# EasyEDA Pro project ProPrj_智能视觉集成板-V1.1.epro, board PCB2
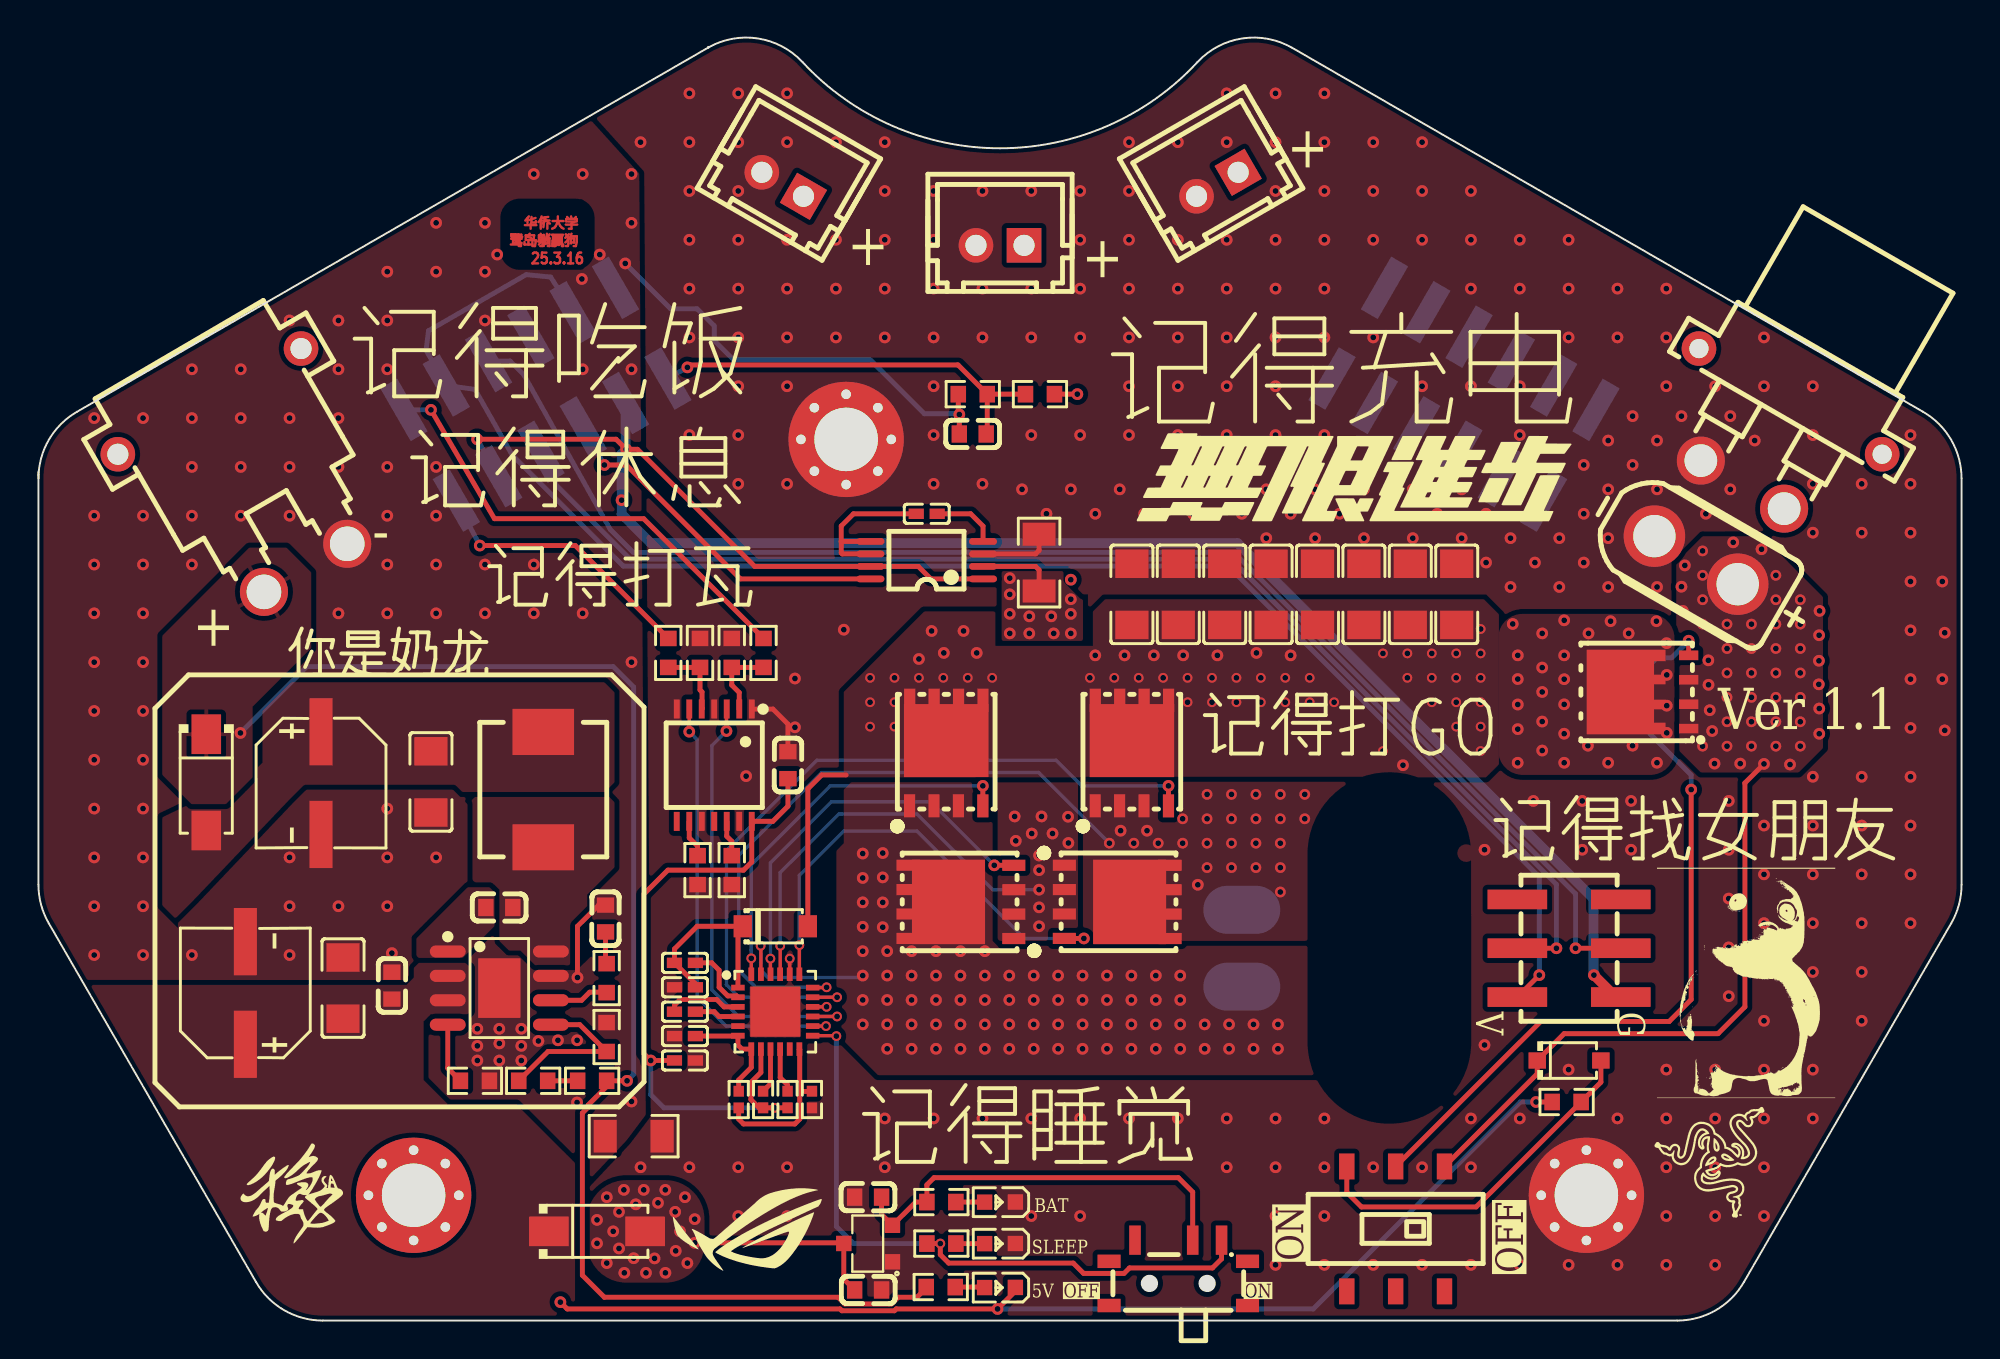
[diagram p13: board, top side]
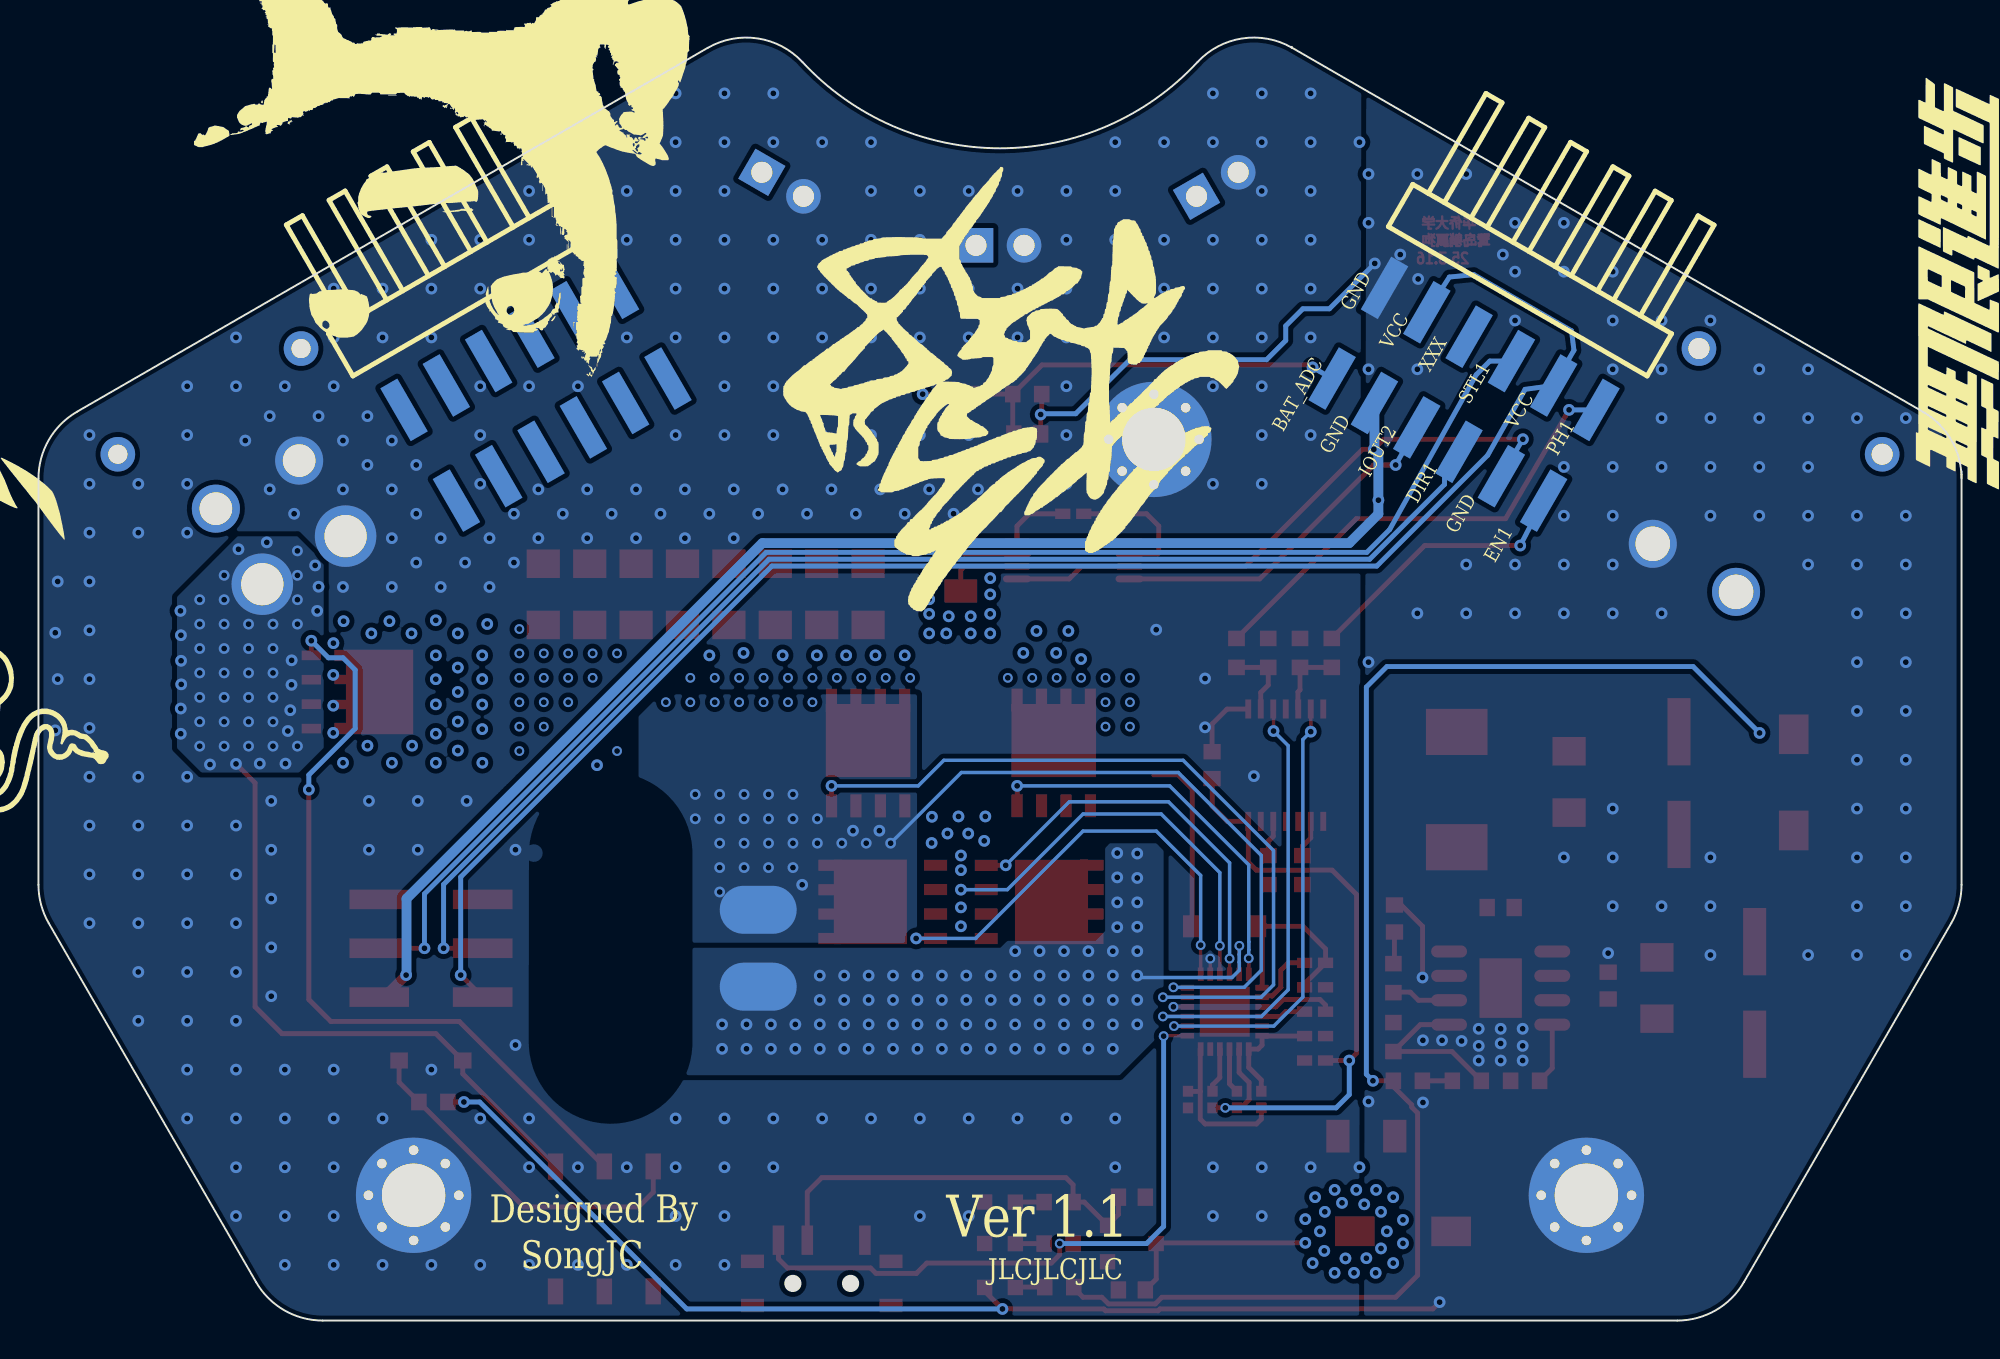
[diagram p14: board, bottom side, seen from below]

Outline 100 x 66.72 mm; copper layers: Top Layer, Inner1, Inner2, Bottom Layer. Coordinates in mm from the lower left corner of the outline.
Outline path: 0,44.19 0,22.67 arc(0.14,21.64) 0.54,20.67 11.32,2 arc(12.78,0.54) 14.78,0 85.22,0 arc(87.22,0.54) 88.68,2 99.46,20.67 arc(99.86,21.64) 100,22.67 100,43.82 arc(99.46,45.82) 98,47.29 65.2,66.22 arc(62.6,66.72) 60.27,65.48 arc(50,61) 39.73,65.48 arc(37.4,66.72) 34.82,66.24 arc(34.84,66.24) 34.84,66.25 2,47.29 arc(0.54,45.82) 0,43.82 ; 34.83,66.28 arc(34.83,66.28) 34.83,66.28
Stack: Top Layer 0.035mm 外层铜厚1oz / Dielectric1 0.2104mm 7628 RC49% 8.6mil / Inner1 0.0152mm 内层铜厚 / Dielectric2 1.065mm 1.1mm H/HOZ Copper / Inner2 0.0152mm 内层铜厚 / Dielectric3 0.2104mm 7628 RC49% 8.6mil / Bottom Layer 0.035mm 外层铜厚1oz

## Design rules (mm)
template: 自定义配置
spacing copperThickness1oz (default): track to track 0.102, other pairs 0.152 to 0.3
spacing copperThickness2oz: track to track 0.203, other pairs 0.152 to 0.3
track width copperThickness1oz (default): min 0.127, default 0.254, max 2.54
track width copperThickness2oz: min 0.203, default 0.254, max 2.54
differential pair differentialPair (default): width min 0.127, default 0.254, max 2.54; gap min 0.152, default 0.152
via viaSize (default): diameter min 0.5, default 0.61, max 10; hole min 0.3, default 0.305, max 6.3
net SH2_1 uses REALZHILIAN
net SH1_1 uses REALZHILIAN
net SP_1 uses REALZHILIAN
net GL1_1 uses REALZHILIAN
net VCC_BAT uses REALZHILIAN, innerPlane1
net GND_MOTO uses REALZHILIAN, innerPlane1
net $3N3808 uses REALZHILIAN
net GND_BAT uses REALZHILIAN, innerPlane1
net $3N3805 uses REALZHILIAN
net $3N3801 uses REALZHILIAN
net $3N3802 uses REALZHILIAN
net +12V_IN uses REALZHILIAN, innerPlane1

## Placement (name value [footprint] x y rotation side)
C12  100nF  [C0603]  48.58 46.13 0 top
C44  1nF  [C0603]  43.14 1.59 180 top
C45  1nF  [C0603]  43.14 6.42 0 top
C78  100uF  [CAP-SMD_BD6.3-L6.6-W6.6-LS7.4-FD]  10.76 17.05 90 top
C79  100nF  [C0603]  18.38 17.43 270 top
C80  4.7uF  [c1206]  15.84 17.3 270 top
C81  100nF  [C0603]  23.97 21.49 0 top
C82  47uF  [c1206]  20.41 28.03 90 top
C83  4.7nF  [C0603]  29.49 20.92 90 top
C84  100uF  [CAP-SMD_BD6.3-L6.6-W6.6-LS7.4-FD]  14.69 27.97 270 top
C94  22uF  [c1206]  61.68 37.79 270 top
C95  22uF  [c1206]  64.1 37.79 270 top
C96  22uF  [c1206]  66.51 37.79 270 top
C120  100nF  [C0402]  33.62 17.34 0 top
C121  100nF  [C0402]  33.62 18.61 0 top
C122  100nF  [C0402]  33.62 16.07 0 top
C126  1uF  [C0402]  33.62 14.8 0 top
C127  1uF  [C0402]  33.62 13.53 180 top
C130  100nF  [C0402]  46.19 41.98 0 top
C132  100nF  [C0603]  38.97 28.9 270 top
C133  22uF  [c1206]  56.86 37.79 270 top
C134  22uF  [c1206]  59.27 37.79 270 top
C135  22uF  [c1206]  68.92 37.79 270 top
C136  22uF  [c1206]  71.34 37.79 270 top
C142  22uF  [c1206]  73.75 37.79 270 top
CN6  XT30PW-M30.G.Y  [CONN-TH_XT30PW-M]  11.39 43.5 210 top
CN13  ZX-XH2.54-2PZZ  [CONN-TH_2P-P2.50_HX25003-2A]  38.7 59.12 150 top
CN14  ZX-XH2.54-2PZZ  [CONN-TH_2P-P2.50_HX25003-2A]  50 55.95 180 top
CN15  XT30UPB-F30.G.Y  [CONN-TH_XT30UPB-F]  86.19 39.57 150 top
CN16  ZX-XH2.54-2PZZ  [CONN-TH_2P-P2.50_HX25003-2A]  61.3 59.12 210 top
D2  BZT52C16  [SOD-123_L2.7-W1.7-LS3.8-RD]  79.59 13.53 0 top
D24  SS54  [SMA_L4.4-W2.8-LS5.4-R-RD]  29.04 4.64 0 top
D25  SS54  [SMA_L4.4-W2.8-LS5.4-R-RD]  8.72 28.01 270 top
D28  B5819W  [SOD-123_L2.8-W1.8-LS3.7-RD]  38.32 20.52 0 top
J1  -  [M3螺帽]  19.51 6.52 0 top
J3  -  [M3螺帽]  42 45.85 0 top
J4  -  [M3螺帽]  80.49 6.52 0 top
L4  4.7uH  [IND-SMD_L7.0-W6.6]  26.25 27.63 90 top
LED4  NCD0603R1  [LED0603-RD_RED]  50 6.17 180 top
LED5  NCD0603R1  [LED0603-RD_RED]  50 4.01 180 top
LED6  NCD0603R1  [LED0603-RD_RED]  50 1.72 180 top
Q11  TPH1R403NL  [POWERVDFN-8_L6.2-W5.2-P1.27-LS6.0-BL]  84.04 32.71 90 top
Q21  IRFH7440TRPBF  [DFN-8_L5.8-W4.9-P1.27-LS6.0-BL-1]  47.21 29.53 0 top
Q22  IRFH7440TRPBF  [DFN-8_L5.8-W4.9-P1.27-LS6.0-BL-1]  47.97 21.79 90 top
Q23  IRFH7440TRPBF  [DFN-8_L5.8-W4.9-P1.27-LS6.0-BL-1]  56.86 29.53 0 top
Q24  IRFH7440TRPBF  [DFN-8_L5.8-W4.9-P1.27-LS6.0-BL-1]  56.1 21.79 270 top
R10  10K  [R0603]  79.46 11.37 0 top
R13  200kΩ  [R0603]  52.08 48.21 180 top
R14  20kΩ  [R0603]  48.58 48.21 180 top
R68  2.2K  [R0603]  46.95 6.17 180 top
R69  2.2K  [R0603]  46.95 4.01 180 top
R89  100R  [R0603]  37.7 34.74 90 top
R90  100R  [R0603]  32.75 34.74 90 top
R126  200K  [R0603]  22.69 12.48 180 top
R127  51K  [R0603]  28.79 12.48 0 top
R128  1.5K  [R0603]  25.73 12.48 0 top
R129  10K  [R0603]  29.54 14.75 270 top
R130  4.7K  [R0603]  46.92 1.74 180 top
R131  20K  [R0603]  29.54 17.82 90 top
R161  10kΩ  [R0402]  37.68 11.5 90 top
R162  10kΩ  [R0402]  38.95 11.5 90 top
R165  1kΩ  [R0402]  36.41 11.5 270 top
R168  33kΩ  [R0402]  40.22 11.5 90 top
R173  10kΩ  [R0603]  34.4 34.74 270 top
R174  10kΩ  [R0603]  36.05 34.74 270 top
R175  10kΩ  [R0603]  34.27 23.44 90 top
R176  10kΩ  [R0603]  36.05 23.44 90 top
R180  0Ω  [R1206]  30.95 9.59 0 top
SW1  SS-3235S-L3  [SW-SMD_SS-3235S-L3.00]  70.57 4.77 0 top
SW4  MSK12C02  [SW-TH_MSK12C02]  59.27 2.48 0 top
U10  LR8341A-T33  [SOT-23-3L_L2.9-W1.6-P1.90-LS2.8-BL]  43.14 4.01 90 top
U11  SN74HC125PWR  [TSSOP-14_L5.0-W4.4-P0.65-LS6.5-BL]  35.14 28.9 180 top
U27  SP1N28STER  [ESOP-8_L4.9-W3.9-P1.27-LS6.0-BL-EP3.1]  23.97 17.3 270 top
U37  100mΩ  [R1206]  52.03 39.44 90 top
U39  DRV8701ERGER  [VQFN-24_L4.0-W4.0-P0.50-BL-EP2.5]  38.32 16.07 270 top
U41  INA240A2PWR  [TSSOP-8_L4.4-W3.0-P0.65-LS6.4-BL]  46.19 39.57 90 top
U56  XT30PW-F20.G.Y  [CONN-TH_XT30PW-F-1]  89.86 45.66 150 top
U58  PZ254-2-06-WS  [HDR-SMD_12P-P2.54_HCTL_PZ254-2-06-WS]  74.13 48.2 330 bottom
U60  -  [2P焊接端子（大电流）]  62.57 19.37 0 bottom
母版连接  PZ254-2-06-WS  [HDR-SMD_12P-P2.54_HCTL_PZ254-2-06-WS]  25.87 48.2 30 bottom
编码器1  PZ254-2-03-S  [HDR-SMD_6P-P2.54-V-M-R2-C3-LS7.5-2]  79.59 19.37 90 top

## Footprints (pads in the part's own frame, mm; a bottom-side part is the same pattern mirrored in y, then rotated)
2P焊接端子（大电流）
  oval 4x2.5 smd: 1(0,2) 2(0,-2)
C0402
  rect 0.79x0.54 smd: 1(-0.545,0) 2(0.545,0)
C0603
  rect 0.8x0.9 smd: 1(-0.7,0) 2(0.7,0)
c1206
  rect 1.485x1.728 smd: 1(-1.593,0) 2(1.593,0)
CAP-SMD_BD6.3-L6.6-W6.6-LS7.4-FD
  rect 3.5x1.2 smd: 1(-2.67,0) 2(2.67,0)
CONN-TH_2P-P2.50_HX25003-2A
  rect 1.8x1.8 hole 1.1: 1(-1.25,0)
  round 1.8 hole 1.1: 2(1.25,0)
CONN-TH_XT30PW-F-1
  round 2.5 hole 1.7: 1(-2.5,2.5) 2(2.5,2.5)
  round 1.8 hole 1: 3(5.5,-2.5) 4(-5.5,-2.5)
CONN-TH_XT30PW-M
  round 2.5 hole 1.8: 1(-2.5,5) 2(2.5,5)
  round 1.8 hole 1.1: 3(5.5,-5) 4(-5.5,-5)
CONN-TH_XT30UPB-F
  round 3.2 hole 2.2: 1(-2.5,0) 2(2.5,0)
DFN-8_L5.8-W4.9-P1.27-LS6.0-BL-1
  rect 0.58x1.2 smd: 1(-1.907,-2.75) 2(-0.637,-2.75) 3(0.632,-2.75) 4(1.903,-2.75) 5(1.907,2.75) 6(0.637,2.75) 7(-0.632,2.75) 8(-1.903,2.75)
  rect 4.4x3.8 smd: 9(0,0.646)
ESOP-8_L4.9-W3.9-P1.27-LS6.0-BL-EP3.1
  oval 0.63x1.865 smd: 1(-1.905,-2.683) 2(-0.635,-2.683) 3(0.635,-2.683) 4(1.905,-2.683) 5(1.905,2.683) 6(0.635,2.683) 7(-0.635,2.683) 8(-1.905,2.683)
  rect 3.1x2.2 smd: 9(0,0)
HDR-SMD_6P-P2.54-V-M-R2-C3-LS7.5-2
  rect 1.02x3.1 smd: 1(-2.54,-2.69) 2(-2.54,2.69) 3(0,-2.69) 4(0,2.69) 5(2.54,-2.69) 6(2.54,2.69)
HDR-SMD_12P-P2.54_HCTL_PZ254-2-06-WS
  rect 1.02x3.17 smd: 1(-6.35,-2.725) 2(-6.35,2.725) 3(-3.81,-2.725) 4(-3.81,2.725) 5(-1.27,-2.725) 6(-1.27,2.725) 7(1.27,-2.725) 8(1.27,2.725) 9(3.81,-2.725) 10(3.81,2.725) 11(6.35,-2.725) 12(6.35,2.725)
IND-SMD_L7.0-W6.6
  rect 2.4x3.2 smd: 1(-3,0) 2(3,0)
LED0603-RD_RED
  rect 0.8x0.8 smd: 1(-0.799,-0.004) 2(0.799,0.004)
M3螺帽
  round 6 hole 3.302: 1(0,0)
  round 1 hole 0.5: 2(0,2.349) 3(0,-2.349) 4(2.349,0) 5(-2.349,0) 6(1.651,1.651) 7(-1.651,-1.651) 8(1.651,-1.651) 9(-1.651,1.651)
POWERVDFN-8_L6.2-W5.2-P1.27-LS6.0-BL
  rect 0.5x1 smd: 1(-1.905,-1.775) 2(-0.635,-1.775) 3(0.635,-1.775) 4(1.905,-1.775)
  custom 4.4x4.1 smd: 5(0,1.775)
R0402
  rect 0.566x0.54 smd: 1(-0.433,0) 2(0.433,0)
R0603
  rect 0.806x0.864 smd: 1(-0.753,0) 2(0.753,0)
R1206
  rect 1.208x1.701 smd: 1(-1.479,0) 2(1.479,0)
SMA_L4.4-W2.8-LS5.4-R-RD
  rect 2.062x1.539 smd: 1(2.503,0) 2(-2.503,0)
SOD-123_L2.7-W1.7-LS3.8-RD
  rect 0.91x0.84 smd: 1(-1.655,0) 2(1.655,0)
SOD-123_L2.8-W1.8-LS3.7-RD
  rect 0.95x1.15 smd: 1(-1.692,0) 2(1.692,0)
SOT-23-3L_L2.9-W1.6-P1.90-LS2.8-BL
  rect 0.8x0.8 smd: 1(-0.95,-1.265) 2(0.95,-1.265) 3(0.005,1.265)
SW-SMD_SS-3235S-L3.00
  rect 0.8x1.35 smd: 1(-2.54,3.25) 2(0,3.25) 3(2.54,3.25) 4(-2.54,-3.25) 5(0,-3.25) 6(2.54,-3.25)
SW-TH_MSK12C02
  rect 0.6x1.524 smd: 1(-2.25,1.7) 2(0.75,1.7) 3(2.25,1.7)
  rect 1.2x0.7 smd: 4(-3.6,0.6) 4(-3.6,-1.7) 4(3.6,0.6) 4(3.6,-1.7)
TSSOP-8_L4.4-W3.0-P0.65-LS6.4-BL
  oval 0.353x1.454 smd: 1(-0.975,-2.927) 2(-0.325,-2.927) 3(0.325,-2.927) 4(0.975,-2.927) 5(0.975,2.927) 6(0.325,2.927) 7(-0.325,2.927) 8(-0.975,2.927)
TSSOP-14_L5.0-W4.4-P0.65-LS6.5-BL
  rect 0.305x0.991 smd: 1(-1.95,-2.925) 2(-1.3,-2.925) 3(-0.65,-2.925) 4(0,-2.925) 5(0.65,-2.925) 6(1.3,-2.925) 7(1.95,-2.925) 8(1.95,2.925) 9(1.3,2.925) 10(0.65,2.925) 11(0,2.925) 12(-0.65,2.925) 13(-1.3,2.925) 14(-1.95,2.925)
VQFN-24_L4.0-W4.0-P0.50-BL-EP2.5
  rect 0.3x0.7 smd: 1(-1.25,-1.942) 2(-0.75,-1.942) 3(-0.25,-1.942) 4(0.25,-1.942) 5(0.75,-1.942) 6(1.25,-1.942) 13(1.25,1.942) 14(0.75,1.942) 15(0.25,1.942) 16(-0.25,1.942) 17(-0.75,1.942) 18(-1.25,1.942)
  rect 0.7x0.3 smd: 7(1.948,-1.25) 8(1.948,-0.75) 9(1.948,-0.25) 10(1.948,0.25) 11(1.948,0.75) 12(1.948,1.25) 19(-1.948,1.25) 20(-1.948,0.75) 21(-1.948,0.25) 22(-1.948,-0.25) 23(-1.948,-0.75) 24(-1.948,-1.25)
  rect 2.6x2.6 smd: 25(0.001,-0.001)

## Nets
As in the schematic, except:
GND_BAT: C12.1 C78.2 C79.1 C80.1 C82.1 C83.2 C84.2 CN6.1 J1.1 J1.2 J1.3 J1.4 J1.5 J1.6 J1.7 J1.8 J1.9 LED6.1 R10.1 R14.2 R126.1 R129.1 R180.1 U27.7 U27.9 母版连接.11
GND_MOTO: C44.1 C45.1 C94.1 C95.1 C96.1 C120.1 C126.1 C127.1 C132.1 C133.1 C134.1 C135.1 C136.1 C142.1 CN13.2 CN14.2 CN15.2 CN16.2 J3.1 J3.2 J3.3 J3.4 J3.5 J3.6 J3.7 J3.8 J3.9 J4.1 J4.2 J4.3 J4.4 J4.5 J4.6 J4.7 J4.8 J4.9 LED4.1 LED5.1 R168.1 R173.1 R174.1 R175.1 R176.1 R180.2 U10.1 U11.1 U11.4 U11.7 U11.10 U11.13 U37.2 U39.5 U39.16 U39.20 U39.25 U41.3 U56.2

Pads without a net: CN6 3 4; SW1 4 5 6; SW4 1 4; U11 8 11; U39 11; U56 3 4; U58 1 2 3 4 5 6 7 8 9 10 11 12; 母版连接 7; 编码器1 5 6

## Via types
v1: diameter 0.508, hole 0.305, Top Layer to Bottom Layer, 58 vias
v2: diameter 0.61, hole 0.305, Top Layer to Bottom Layer, 586 vias
v3: diameter 0.559, hole 0.305, Top Layer to Bottom Layer, 56 vias

## Routing (per net, layer and track width the routed paths; a pad name or vN(x,y) marks a point on that pad's centre or on a via; arc(x,y) is an arc through that point)
+3V3: length 21.7
  Top Layer w0.254: C45.2 43.84,5.52 44.41,4.96 45.62,6.17 R68.2 46.2,7.06 46.57,7.44 59.27,7.44 60.02,6.69 SW4.2
+12V_IN: length 32.5
  Top Layer w0.254: v2(89.73,28.97) 88.74,27.97 88.74,16.33 87.34,14.93 79.33,14.93 D2.1 77.94,12.84 SW1.3
  vias: v2(85.44,38.19) v2(85.51,36.93) v2(85.61,39.3) v2(86.83,34.36) v2(86.84,33.08) v2(86.91,31.76) v2(87.03,30.68) v2(87.16,28.98) v2(88.13,40.49) v2(88.49,28.98) v2(89.6,40.14) v2(91.08,28.93) v2(92.62,36.93) v2(92.59,35.66) v2(92.59,34.33) v2(92.58,33.11) v2(92.6,31.85) v2(92.6,30.53) v3(86.53,40.05) v3(86.53,38.78) v3(86.53,37.51) v3(86.53,36.24) v3(86.53,29.89) v3(87.81,36.24) v3(87.81,34.97) v3(87.81,33.7) v3(87.81,32.43) v3(87.81,31.16) v3(87.81,29.89) v3(89.07,36.24) v3(89.07,34.97) v3(89.07,33.7) v3(89.07,32.43) v3(89.07,31.16) v3(89.07,29.89) v3(90.34,38.78) v3(90.34,37.51) v3(90.34,36.24) v3(90.34,34.97) v3(90.34,33.7) v3(90.34,32.43) v3(90.34,31.16) v3(90.34,29.89) v3(91.62,37.51) v3(91.62,36.24) v3(91.62,34.97) v3(91.62,33.7) v3(91.62,32.43) v3(91.62,31.16) v3(91.62,29.89)
AVDD_1: length 6
  Top Layer w0.254: C126.2 36.35,14.8 U39.6 36.37,14.33 36.58,14.13 U39.7 37.07,13.17 36.41,12.52 R165.1
DVDD_1: length 35.5
  Top Layer w0.254: 33.07,13.53 v2(31.84,13.53) 31.46,13.91 31.46,22.17 32.73,23.44 36.66,23.44 37.09,23.86 37.09,25.97 37.09,25.98 38.19,25.98 38.97,26.76 C132.2 ; R162.1 v1(38.28,11.07) R161.1 37.48,11.07 37.05,11.5 37.05,12.39 37.57,12.91 U39.8
  Bottom Layer w0.254: v1(38.28,11.07) 32.52,11.07 31.84,11.75 v2(31.84,13.53)
GND_BAT: length 85.5
  Top Layer w0.254: C83.2 29.13,21.62 28.03,20.52 v2(28.03,17.85) ; LED6.1 50.8,1.53 v2(49.87,0.6) 44.6,0.6 44.5,0.51 41.78,0.51 41.68,0.6 27.49,0.6 v2(27.14,0.96) ; R14.2 47.83,47.2 v2(47.88,47.15) C12.1 ; R10.1 v2(77.88,11.37)
  Bottom Layer w0.254: v2(47.88,47.15) 47.85,47.19 46.06,47.19 43.25,50 36.14,50 35.14,51 35.14,51.76 34.25,52.65 32.87,52.65 v2(30.51,55.01) ; v2(77.88,11.37) 77.06,11.37 66.29,0.6 v2(49.87,0.6)
  vias: v2(2.9,46.96) v2(2.9,41.88) v2(2.9,39.34) v2(2.9,36.8) v2(2.9,34.26) v2(2.9,31.72) v2(2.9,29.18) v2(2.9,26.64) v2(2.9,24.1) v2(2.9,21.56) v2(2.9,19.02) v2(5.44,46.96) v2(5.44,41.88) v2(5.44,39.34) v2(5.44,36.8) v2(5.44,34.26) v2(5.44,31.72) v2(5.44,29.18) v2(5.44,26.64) v2(5.44,24.1) v2(5.44,21.56) v2(5.44,19.02) v2(7.98,49.5) v2(7.98,46.96) v2(7.98,44.42) v2(7.98,41.88) v2(7.98,39.34) v2(7.98,19.02) v2(10.52,49.5) v2(10.52,46.96) v2(10.52,44.42) v2(10.52,41.88) v2(13.06,52.04) v2(13.06,46.96) v2(13.06,44.42) v2(13.06,41.88) v2(13.06,24.1) v2(13.06,21.56) v2(13.06,19.02) v2(15.6,52.04) v2(15.6,49.5) v2(15.6,46.96) v2(15.6,44.42) v2(15.6,36.8) v2(15.6,21.56) v2(18.14,54.58) v2(18.14,52.04) v2(18.14,49.5) v2(18.14,44.42) v2(18.14,41.88) v2(18.14,39.34) v2(18.14,36.8) v2(18.14,26.64) v2(18.14,24.1) v2(18.14,21.56) v2(18.38,19.12) v2(20.68,57.12) v2(20.68,54.58) v2(20.68,44.42) v2(20.68,41.88) v2(20.68,39.34) v2(20.68,36.8) v2(20.68,24.1) v2(22.82,15.18) v2(22.82,14.29) v2(22.82,13.53) v2(23.22,57.12) v2(23.22,54.58) v2(23.22,52.04) v2(23.22,39.34) v2(23.22,36.8) v2(23.85,55.47) v2(23.97,15.18) v2(23.97,14.42) v2(23.97,13.53) v2(25.11,15.18) v2(25.11,14.29) v2(25.11,13.53) v2(25.76,59.66) v2(25.76,39.34) v2(25.76,36.8) v2(26,14.55) v2(27.01,14.58) v2(28.01,14.58) v2(28.01,11.35) v2(28.3,59.66) v2(28.26,54.2) v2(28.3,49.5) v2(28.3,36.8) v2(29.19,55.47) v2(30.84,59.66) v2(30.84,57.12) v2(30.84,49.5) v2(30.84,34.26) v2(30.84,11.4)
GND_MOTO: length 9
  Top Layer w0.178: U39.16 40.98,16.32 v1(40.98,16.33) ; v1(39.07,18.84) U39.20
  Top Layer w0.254: C132.1 38.97,31.04 38.19,31.82 37.09,31.82 37.09,31.82 ; U37.2 52.03,40.08 51.85,39.89 U41.3
  vias: v2(31.31,61.32) v2(31.31,7.98) v2(33.85,63.86) v2(33.85,61.32) v2(33.85,58.78) v2(33.85,56.24) v2(33.85,53.7) v2(33.85,51.16) v2(33.85,46.08) v2(33.85,7.98) v2(36.39,63.86) v2(36.39,61.32) v2(36.39,58.78) v2(36.39,56.24) v2(36.39,53.7) v2(36.39,51.16) v2(36.39,48.62) v2(36.39,46.08) v2(36.39,43.54) v2(36.39,7.98) v2(36.39,5.44) v2(36.8,28.33) v2(38.93,63.86) v2(38.93,61.32) v2(38.93,56.24) v2(38.93,53.7) v2(38.93,51.16) v2(38.93,48.62) v2(38.93,43.54) v2(38.93,7.98) v2(38.93,5.44) v2(39.34,33.41) v2(39.34,30.87) v2(41.47,61.32) v2(41.47,56.24) v2(41.47,53.7) v2(41.47,51.16) v2(41.88,35.95) v2(44.01,61.32) v2(44.01,58.78) v2(44.01,56.24) v2(44.01,53.7) v2(44.01,51.16) v2(44.01,10.52) v2(44.01,7.98) v2(46.55,58.78) v2(46.55,56.24) v2(46.55,53.7) v2(46.55,51.16) v2(46.55,48.62) v2(46.55,46.08) v2(46.55,43.54) v2(46.55,10.52) v2(49.09,58.78) v2(49.09,53.7) v2(49.09,51.16) v2(49.09,43.54) v2(49.09,10.52) v2(51.15,43.25) v2(51.63,58.78) v2(51.63,53.7) v2(51.63,51.16) v2(51.63,46.08) v2(51.63,10.52) v2(51.63,5.44) v2(52.42,41.98) v2(53.69,43.25) v2(54.17,58.78) v2(54.17,56.24) v2(54.17,53.7) v2(54.17,51.16) v2(54.17,46.08) v2(54.17,10.52) v2(54.17,5.44) v2(54.96,41.98) v2(56.23,43.25) v2(56.71,61.32) v2(56.71,58.78) v2(56.71,56.24) v2(56.71,53.7) v2(56.71,51.16) v2(56.71,48.62) v2(56.71,46.08) v2(56.71,10.52) v2(57.5,41.98) v2(58.77,43.25) v2(59.25,61.32) v2(59.25,56.24) v2(59.25,53.7) v2(59.25,51.16) v2(59.25,48.62) v2(59.25,46.08) v2(59.25,10.52) v2(60.04,41.98) v2(61.31,43.25) v2(61.79,63.86) v2(61.79,61.32) v2(61.79,56.24) v2(61.79,53.7) v2(61.79,51.16) v2(61.79,48.62) v2(61.79,46.08) v2(61.79,10.52) v2(61.79,7.98) v2(62.58,41.98) v2(63.85,43.25) v2(63.85,40.71) v2(64.33,63.86) v2(64.33,61.32) v2(64.33,58.78) v2(64.33,56.24) v2(64.33,53.7) v2(64.33,51.16) v2(64.33,48.62) v2(64.33,46.08) v2(64.33,10.52) v2(64.33,7.98) v2(64.33,5.44) v2(64.33,2.9) v2(65.12,41.98) v2(66.39,43.25) v2(66.39,40.71) v2(66.87,63.86) v2(66.87,61.32) v2(66.87,58.78) v2(66.87,56.24) v2(66.87,53.7) v2(66.87,51.16) v2(66.87,46.08) v2(66.87,10.52) v2(66.87,7.98) v2(66.87,5.44) v2(66.87,2.9) v2(67.66,41.98) v2(68.93,43.25) v2(68.93,40.71) v2(69.41,61.32) v2(69.41,58.78) v2(69.41,56.24) v2(69.41,51.16) v2(69.41,7.98) v2(69.41,2.9) v2(70.2,41.98) v2(71.47,43.25) v2(71.47,40.71) v2(71.95,61.32) v2(71.95,58.78) v2(71.95,56.24) v2(71.95,48.62) v2(71.95,7.98) v2(71.95,2.9) v2(72.74,41.98) v2(74.01,43.25) v2(74.01,40.71) v2(74.49,58.78) v2(74.49,56.24) v2(74.49,53.7) v2(74.49,48.62) v2(74.49,10.52) v2(74.49,7.98) v2(74.49,2.9) v2(75.2,24.5) v2(75.2,14.34) v2(75.28,41.98) v2(75.28,39.44) v2(76.55,40.71) v2(76.55,38.17) v2(77.03,56.24) v2(77.03,53.7) v2(77.03,48.62) v2(77.03,46.08) v2(77.03,43.54) v2(77.03,10.52) v2(77.03,2.9) v2(77.74,27.04) v2(77.82,39.44) v2(79.09,40.71) v2(79.09,38.17) v2(79.57,56.24) v2(79.57,53.7) v2(79.57,51.16) v2(79.57,13.06) v2(79.57,2.9) v2(80.28,27.04) v2(80.28,24.5) v2(80.36,44.52) v2(80.36,41.98) v2(80.36,39.44) v2(81.63,45.79) v2(81.63,43.25) v2(81.63,40.71) v2(81.63,38.17) v2(82.11,53.7) v2(82.11,51.16) v2(82.11,10.52) v2(82.11,2.9) v2(82.82,27.04) v2(82.82,24.5) v2(82.9,47.06) v2(82.9,44.52) v2(84.17,45.79) v2(84.17,43.25) v2(84.17,38.17) v2(84.65,53.7) v2(84.65,51.16) v2(84.65,48.62) v2(84.65,13.06) v2(84.65,10.52) v2(84.65,7.98) v2(84.65,5.44) v2(84.65,2.9) v2(85.44,47.06) v2(86.71,41.98) v2(87.19,48.62) v2(87.19,13.06) v2(87.19,10.52) v2(87.19,7.98) v2(87.19,5.44) v2(87.19,2.9) v2(87.9,27.04) v2(87.9,24.5) v2(87.9,21.96) v2(87.9,19.42) v2(87.9,16.88) v2(87.98,47.06) v2(87.98,43.25) v2(89.25,45.79) v2(89.73,51.16) v2(89.73,48.62) v2(89.73,25.76) v2(89.73,23.22) v2(89.73,20.68) v2(89.73,18.14) v2(89.73,15.6) v2(89.73,13.06) v2(89.73,10.52) v2(89.73,7.98) v2(89.73,5.44) v2(92.27,48.62) v2(92.27,46.08) v2(92.27,43.54) v2(92.27,41) v2(92.27,28.3) v2(92.27,25.76) v2(92.27,23.22) v2(92.27,20.68) v2(92.27,18.14) v2(92.27,15.6) v2(92.27,13.06) v2(92.27,10.52) v2(94.81,43.54) v2(94.81,41) v2(94.81,28.3) v2(94.81,25.76) v2(94.81,23.22) v2(94.81,20.68) v2(94.81,18.14) v2(94.81,15.6) v2(97.35,46.08) v2(97.35,43.54) v2(97.35,41) v2(97.35,38.46) v2(97.35,35.92) v2(97.35,33.38) v2(97.35,30.84) v2(97.35,28.3) v2(97.35,25.76) v2(97.35,23.22) v2(97.35,20.68) v2(99,38.46) v2(99,33.38) v2(99.13,35.79) v2(99.13,30.71)
GND_PRO: length 102.1
  Top Layer w0.254: U41.1 46.4,38.59 45.75,39.24 U41.7 37.24,39.24 31.15,45.34 v2(30.56,45.34) 30.03,45.86 v2(22.81,45.86)
  Top Layer w0.508: v2(80.88,17.98) 82.03,16.83 编码器1.1
  Bottom Layer w0.254: v2(22.81,45.86) 母版连接.4
  Bottom Layer w0.508: 母版连接.10 30.53,45.37 v2(30.56,45.34) 30.32,45.1 v2(30.32,42.69) 30.32,41.97 31.84,40.46 62.36,40.46 80.86,21.95 80.86,18 v2(80.88,17.98)
VCC_3V3: length 87.1
  Top Layer w0.254: v2(78.04,17.98) 编码器1.2
  Bottom Layer w0.254: v2(78.04,17.98) 78.04,23.08 61.86,39.26 30.41,39.26 24.64,45.03 22.69,48.46 母版连接.3 20.16,50.49 20.28,51.5 25.36,54.43 26.63,54.3 母版连接.9
VCC_+5V: length 73.7
  Top Layer w0.254: 29.84,12.48 R127.2 ; 29.84,12.48 v2(30.61,12.48) ; 29.84,12.48 28.59,11.22 28.59,11.11 28.28,10.8 28.28,2.36 29.43,1.21 41.58,1.21 41.93,0.87 44.36,0.87 44.71,1.21 45.68,1.21 46.17,1.7 R130.2
  Bottom Layer w0.254: v2(30.61,12.48) 30.95,12.82 30.95,32.96 29.88,34.03 13.96,34.03 v2(10.5,30.58)
VCC_BAT: length 21.1
  Top Layer w0.254: C44.2 41.88,2.16 U10.3 41.84,4.05 v2(34.12,4.05) ; D28.2 40.01,27.67 40.73,28.39 42,28.39 ; R13.1 v2(54.02,48.21)
  vias: v1(43.24,33.45) v1(43.24,32.18) v1(43.24,30.91) v1(44.51,33.45) v1(44.51,32.18) v1(44.51,30.91) v1(45.78,33.45) v1(47.05,33.45) v1(48.32,33.45) v1(49.59,33.45) v1(54.67,33.45) v1(55.94,33.45) v1(57.21,33.45) v1(58.48,33.45) v1(59.75,33.45) v1(59.75,32.18) v1(61.02,33.45) v1(61.02,32.18) v1(62.29,33.45) v1(62.29,32.18) v1(63.56,33.45) v1(63.56,32.18) v1(64.83,33.45) v1(64.83,32.18) v1(66.1,33.45) v1(66.1,32.18) v1(67.37,32.18) v1(69.91,34.72) v1(69.91,29.64) v1(71.18,34.72) v1(71.18,33.45) v1(72.45,34.72) v1(72.45,33.45) v1(72.45,32.18) v1(73.72,34.72) v1(73.72,33.45) v1(73.72,32.18) v1(73.72,30.91) v1(74.99,35.99) v1(74.99,34.72) v1(74.99,33.45) v1(74.99,32.18) v1(74.99,30.91) v1(74.99,29.64) v2(29.04,5.24) v2(29.04,4.02) v2(29.55,6.42) v2(29.55,2.99) v2(29.89,4.64) v2(30.19,5.66) v2(30.19,3.75) v2(30.44,6.8) v2(30.47,2.48) v2(30.95,3.25) v2(31.06,6.05) v2(31.47,6.8) v2(31.59,2.48) v2(32.04,3.24) v2(32.22,6.12) v2(32.6,6.8) v2(32.6,2.48) v2(33.11,5.66) v2(33.14,3.63) v2(33.36,4.64) v2(33.62,6.42) v2(33.74,2.99) v2(34.12,5.28) v2(45.78,34.43) v2(46.44,35.88) v2(47.08,34.74) v2(48.1,35.88) v2(48.79,34.74) v2(54.95,34.61) v2(56.48,34.61) v2(58,34.61) v2(59.53,34.61) v2(61.3,34.61) v2(63.34,34.74) v2(65.11,34.61) v2(70.96,28.9) v2(76.66,36.25) v2(76.92,34.61) v2(76.92,33.38) v2(76.92,32.06) v2(76.92,30.78) v2(76.92,29.03) v2(78.19,35.76) v2(78.19,33.98) v2(78.19,32.71) v2(78.19,31.17) v2(78.19,29.66) v2(79.34,36.44) v2(79.34,34.61) v2(79.34,33.37) v2(79.34,32.06) v2(79.34,30.54) v2(79.34,29.03) v2(80.6,35.76) v2(80.57,29.92) v2(81.62,29.03) v2(81.75,36.39) v2(82.69,35.76) v2(82.89,29.92) v2(84.13,36.39) v2(84.16,29.03) v2(84.66,35.25) v2(84.67,33.6) v2(84.67,32) v2(84.67,30.58)
BAT_ADC: length 21.5
  Top Layer w0.254: R14.1 47.82,49.73 33.87,49.73 v2(33.74,49.6) ; R14.1 R13.2 ; R14.1 49.34,46.19 C12.2
  Bottom Layer w0.254: v2(33.74,49.6) 母版连接.12
EN-IN_1: length 3.9
  Top Layer w0.254: U11.5 34.51,31.84 34.51,32.71 34.4,32.81 R173.2 R90.1
EN_1: length 23.2
  Top Layer w0.178: v2(33.84,30.64) U11.6 ; v1(40.95,15.32) U39.14
  Bottom Layer w0.178: v2(33.84,30.64) 34.25,30.23 34.25,16.83 35.76,15.32 v1(40.95,15.32)
ENCODER_DIR_1: length 68
  Top Layer w0.254: v2(78.93,19.37) 编码器1.4
  Bottom Layer w0.254: v2(78.93,19.37) 78.93,22.69 62.01,39.62 30.78,39.62 26.89,43.51 26.89,44.45 母版连接.6
ENCODER_STL_1: length 74.6
  Top Layer w0.254: v2(79.93,19.37) 编码器1.3
  Bottom Layer w0.254: 23.41,49.93 24.53,49.93 25.23,49.22 29.74,41.16 30.93,39.97 62.16,39.97 79.93,22.2 v2(79.93,19.37)
ENIN_1: length 14.4
  Top Layer w0.254: v2(22.95,40.33) 27.91,40.33 R90.2
  Bottom Layer w0.254: v2(22.95,40.33) 21.73,42.67
GH1_1: length 40.8
  Top Layer w0.178: v1(41.53,16.82) U39.17
  Top Layer w0.254: v2(58.76,27.82) Q23.4
  Bottom Layer w0.178: v1(41.53,16.82) 36.42,16.82 35.78,17.47 35.78,24.45 40.47,29.15 52.92,29.15 54.25,27.82 v2(58.76,27.82)
GH2_1: length 20.5
  Top Layer w0.178: v1(37.07,18.85) U39.24
  Top Layer w0.254: v2(49.11,27.82) Q21.4
  Bottom Layer w0.178: v1(37.07,18.85) 37.07,19.29 37.06,19.3 37.06,19.71 37.07,19.71 37.07,23.71 41.18,27.82 v2(49.11,27.82)
GL1_1: length 24.2
  Top Layer w0.178: v1(39.57,19.54) U39.19
  Top Layer w0.254: v2(54.36,19.88) Q24.4
  Bottom Layer w0.178: v2(54.36,19.88) 51.27,19.88 45.68,25.47 41.87,25.47 39.57,23.16 v1(39.57,19.54)
GL2_1: length 21.1
  Top Layer w0.178: U39.22 38.06,18.03 v1(38.06,18.84)
  Top Layer w0.254: v2(49.7,23.69) Q22.4
  Bottom Layer w0.178: v1(38.06,18.84) 38.06,23.82 41.24,26.99 46.4,26.99 v2(49.7,23.69)
I_OUT_1: length 18.5
  Top Layer w0.254: v2(29.43,44.52) 30.57,44.52 36.5,38.59 U41.8
  Bottom Layer w0.254: v2(29.43,44.52) 母版连接.8
NSLEEP: length 34.5
  Top Layer w0.178: U39.13 41.47,14.82 v1(41.49,14.8)
  Top Layer w0.254: SW4.3 61.52,3.21 61.05,2.74 56.73,2.74 56.45,2.45 54.35,2.45 53.81,2.99 47.33,2.99 46.9,3.43 v1(46.9,4.01) R69.2
  Bottom Layer w0.254: v1(46.9,4.01) 42.38,4.01 41.49,4.9 v1(41.49,14.8)
PH-IN_1: length 4
  Top Layer w0.254: U11.2 36.44,32.68 36.05,33.07 R174.2 R89.1
PH_1: length 23.3
  Top Layer w0.178: v2(35.78,30.68) 35.78,31.81 U11.3 ; v1(41.53,15.82) U39.15
  Bottom Layer w0.178: v1(41.53,15.82) 36.41,15.82 35.01,17.22 35.01,29.92 v2(35.78,30.68)
PHIN_1: length 24.5
  Top Layer w0.254: v2(20.41,47.39) 23.71,41.73 31.47,41.73 R89.2
  Bottom Layer w0.254: 母版连接.1 v2(20.41,47.39)
SH1_1: length 34.2
  Top Layer w0.178: v1(40.98,17.34) 40.96,17.32 U39.18
  Bottom Layer w0.178: v1(40.98,17.34) 37.3,17.34 36.41,18.23 36.41,24.2 40.73,28.52 52.01,28.52 v3(55.69,24.84)
  vias: v2(56.27,25.49) v2(57.64,25.49) v2(60.29,22.68) v3(56.96,24.84) v3(58.23,24.84) v3(59.5,26.11) v3(59.5,24.84) v3(60.77,27.38) v3(60.77,26.11) v3(60.77,24.84) v3(60.77,23.57) v3(62.04,27.38) v3(62.04,26.11) v3(62.04,24.84) v3(62.04,23.57) v3(63.31,27.38) v3(63.31,26.11) v3(63.31,24.84) v3(63.31,23.57) v3(64.58,27.38) v3(64.58,26.11) v3(64.58,24.84) v3(64.58,23.57) v3(64.58,22.3) v3(65.85,27.38) v3(65.85,26.11)
SH2_1: length 8.2
  Top Layer w0.178: 37.57,19.47 U39.23
  Bottom Layer w0.178: v2(42.86,17.95) 42.76,17.85 37.94,17.85 37.55,18.23 37.55,18.64 37.56,18.64 37.56,19.06 37.55,19.06 v1(37.55,19.5)
  vias: v2(42.86,24.3) v2(42.86,23.03) v2(42.86,21.76) v2(42.86,20.49) v2(42.86,19.22) v2(42.86,16.68) v2(42.86,15.41) v2(43.9,24.33) v2(43.9,23.06) v2(43.9,21.76) v2(43.9,20.47) v2(44.13,19.22) v2(44.13,17.95) v2(44.13,16.68) v2(44.13,15.41) v2(44.13,14.14) v2(45.4,19.22) v2(45.4,17.95) v2(45.4,16.68) v2(45.4,15.41) v2(45.4,14.14) v2(46.67,19.22) v2(46.67,17.95) v2(46.67,16.68) v2(46.67,15.41) v2(46.67,14.14) v2(47.94,19.22) v2(47.94,17.95) v2(47.94,16.68) v2(47.94,15.41) v2(47.94,14.14) v2(49.21,19.22) v2(49.21,17.95) v2(49.21,16.68) v2(49.21,15.41) v2(49.21,14.14) v2(50.48,17.95) v2(50.48,16.68) v2(50.48,15.41) v2(50.48,14.14) v2(51.75,17.95) v2(51.75,16.68) v2(51.75,15.41) v2(51.75,14.14) v2(53.02,17.95) v2(53.02,16.68) v2(53.02,15.41) v2(53.02,14.14) v2(54.29,17.95) v2(54.29,16.68) v2(54.29,15.41) v2(54.29,14.14) v2(55.56,17.95) v2(55.56,16.68) v2(55.56,15.41) v2(55.56,14.14) v2(56.83,17.95) v2(56.83,16.68) v2(56.83,15.41) v2(56.83,14.14) v2(58.1,17.95) v2(58.1,16.68) v2(58.1,15.41) v2(58.1,14.14) v2(59.37,17.95) v2(59.37,16.68) v2(59.37,15.41) v2(59.37,14.14) v2(60.64,15.41) v2(60.64,14.14) v2(61.91,15.41) v2(61.91,14.14) v2(63.18,15.41) v2(63.18,14.14) v2(64.45,15.41) v2(64.45,14.14)
SP_1: length 25.7
  Top Layer w0.178: v1(38.57,19.5) 38.57,18.03 U39.21
  Top Layer w0.254: U41.2 51.85,39.24 52.03,39.06 U37.1
  Bottom Layer w0.178: v1(38.57,19.5) 38.57,23.31 41.62,26.36 45.68,26.36 49.62,22.42 v2(52.03,22.42)
  vias: v2(50.51,38.63) v2(50.51,37.79) v2(50.51,36.77) v2(50.51,35.76) v2(50.76,26.23) v2(50.82,24.96) v2(51.52,36.65) v2(51.52,35.76) v2(51.65,25.34) v2(52.03,24.2) v2(52.03,23.44) v2(52.03,21.5) v2(52.03,20.52) v2(52.16,26.23) v2(52.67,36.65) v2(52.73,25.34) v2(52.79,35.76) v2(53.54,26.22) v2(53.56,24.85) v2(53.68,38.55) v2(53.68,37.53) v2(53.68,36.77) v2(53.68,35.76)
$2N2538: length 2.4
  Top Layer w0.254: U39.9 38.07,12.32 R161.2
$2N2539: length 2.4
  Top Layer w0.254: R162.2 38.95,12.26 38.57,12.64 38.57,14.12 U39.10
$2N2543: length 9.4
  Top Layer w0.254: C120.2 34.16,17.52 C121.1 33.07,19.34 34.25,20.52 36.37,20.52 U39.1
$2N2544: length 3.5
  Top Layer w0.254: C121.2 35.01,18.61 35.4,18.23 35.4,17.34 35.84,16.89 36.3,16.89 U39.2
$2N2545: length 3.9
  Top Layer w0.254: C122.1 33.07,16.42 33.36,16.71 35.27,16.71 35.65,16.32 U39.3
$2N2549: length 8.3
  Top Layer w0.254: 39.59,11.92 39.59,10.48 39.33,10.23 36.66,10.23 36.41,10.48 R165.2 ; 39.59,11.92 40.21,11.92 R168.2 ; 39.59,11.92 39.59,14.11 U39.12
$2N2590: length 2.3
  Top Layer w0.254: U39.4 36.37,15.82 35.4,15.82 35.14,16.07 C122.2
$2N2594: length 1.5
  Top Layer w0.254: LED4.2 49.2,6.17 R68.1
$2N2595: length 1.5
  Top Layer w0.254: R69.1 47.71,4 LED5.2
$2N2609: length 1.9
  Top Layer w0.254: R176.2 36.05,24.94 35.79,25.2 U11.12
$2N2610: length 2
  Top Layer w0.254: U11.9 33.84,25.12 34.27,24.69 R175.2
$2N2632: length 8.6
  Top Layer w0.254: U41.5 41.75,40.54 ; 41.75,40.54 41.75,41.34 42.38,41.98 C130.1 ; 41.75,40.54 41.75,39.95 41.8,39.89 U41.6
$2N2649: length 3.4
  Top Layer w0.254: 46.74,41.98 48.48,41.98 49.12,41.34 U41.4
$3N3799: length 1.7
  Top Layer w0.254: R131.2 29.49,18.63 C83.1
$3N3800: length 3.1
  Top Layer w0.254: U27.6 28.24,16.67 28.66,17.09 29.52,17.09 R131.1
$3N3804: length 8.7
  Top Layer w0.254: U27.5 28.15,15.4 R129.2 26.5,14 R128.1
$3N3806: length 1.5
  Top Layer w0.254: 49.2,1.78 49.16,1.74 R130.1
$3N3807: length 1.6
  Top Layer w0.254: R128.2 R127.1
$3N3809: length 3.2
  Top Layer w0.254: U27.4 21.28,13.14 R126.2
$3N4862: length 40.8
  Top Layer w0.254: v2(85.81,35.38) Q11.4 ; v2(85.94,27.63) 85.94,16.71 84.8,15.56 78.12,15.56 SW1.2
  Bottom Layer w0.254: v2(85.94,27.63) 85.94,28.39 83.53,30.8 83.53,33.85 84.16,34.49 84.92,34.49 v2(85.81,35.38)
$3N4863: length 18.7
  Top Layer w0.254: SW1.1 68.03,6.67 68.8,5.91 74.76,5.91 R10.2 81.25,12.4 D2.2

## Copper pours and planes (outline as drawn; the poured copper is in the pictures)
+12V_IN on Top Layer: 86.54,40.82 85.16,39.44 85.16,29.8 86.45,28.52 91.53,28.52 92.8,29.79 92.8,37.65 89.64,40.81 86.55,40.81
+12V_IN on Bottom Layer: 86.54,40.82 85.16,39.44 85.16,29.8 86.45,28.52 91.53,28.52 92.8,29.79 92.8,37.65 89.64,40.81 86.55,40.81
+12V_IN on Inner1: 85.29,40.68 95.97,40.68 95.97,28.65 85.29,28.65
+12V_IN on Inner2: 85.29,40.68 95.97,40.68 95.97,28.65 85.29,28.65
GND_BAT on Top Layer: 13.27,26.97 8.23,21.67 7.25,20.7 7.25,17.17 10.54,17.17 10.76,16.96 16.85,16.96 17.11,17.22 19.65,17.22 19.77,17.09 19.77,20.01 22.19,22.42 22.31,22.42 22.31,26.87 21.55,27.63 13.93,27.63
GND_BAT on Top Layer: 27.27,64.08 31.24,59.68 31.58,10.71 30.57,9.36 27.9,6.54 27.9,-3.87 8.09,-3.74 -5.63,19.75 -5.63,43.5
GND_BAT on Top Layer: 22.2,19.97 22.2,13.42 22.69,12.92 22.69,11.88 22.95,11.63 28.08,11.63 28.52,12.07 28.52,18.91 27.14,20.29 24.7,20.29 24.35,20.64 22.87,20.64
GND_BAT on Bottom Layer: 31.33,72.33 31.2,-7.93 9.74,-7.3 -7.78,13.79 -9.31,46.81 19.77,66.49
GND_BAT on Inner1: 0.26,62.83 31.46,62.83 31.46,0.26 0.26,0.26
GND_BAT on Inner2: 0.26,62.83 31.46,62.83 31.46,0.26 0.26,0.26
GND_MOTO on Top Layer: 50.13,40.39 49.75,41.09 49.75,44.52 50.13,44.9 79.84,44.9 83.02,48.08 88.61,48.08 89.88,46.81 89.88,45.22 88.74,44.08 88.74,42.11 87.44,40.81 86.55,40.81 85.16,39.43 85.16,37.57 84.37,36.77 76.29,36.77 75.27,37.79 54.32,37.79 53.56,38.55 53.56,39.95 53.11,40.39
GND_MOTO on Top Layer: 26,71.32 26.25,-5.48 107.78,-4.63 105.63,72.46
GND_MOTO on Bottom Layer: 31.2,69.16 31.33,-3.49 94.07,-3.61 108.8,19.12 108.93,49.22 70.32,68.9
GND_MOTO on Inner1: 28.03,66.5 99.74,66.5 99.74,0.26 28.03,0.26
GND_MOTO on Inner1: 49.88,47.95 89.75,47.95 89.75,36.9 49.88,36.9
VCC_+5V on Top Layer: 9.94,39.14 6.44,35.64 6.44,28.39 7.95,26.88 9.75,26.88 11.14,28.26 11.14,31.95 14.19,35 14.19,38.93 12.89,40.22 10.96,40.22 9.94,39.2
VCC_BAT on Top Layer: 41.87,28.26 41.87,32.71 46.06,36.9 49.76,36.9 49.76,35.11 54.83,35.11 54.83,36.9 55.46,37.53 75.27,37.53 75.94,36.86 75.94,28.93 75.27,28.26
VCC_BAT on Top Layer: 28.54,5.28 28.54,5.45 28.59,5.73 28.67,6.01 28.79,6.26 28.95,6.5 29.13,6.71 29.35,6.9 29.58,7.05 29.84,7.17 30.11,7.26 30.39,7.3 30.57,7.31 32.6,7.31 32.78,7.3 33.06,7.26 33.33,7.17 33.59,7.05 33.82,6.9 34.04,6.71 34.22,6.5 34.38,6.26 34.5,6.01 34.58,5.73 34.63,5.45 34.63,5.28 34.63,4.01 34.63,3.83 34.58,3.55 34.5,3.28 34.38,3.02 34.22,2.78 34.04,2.57 33.82,2.38 33.59,2.23 33.33,2.11 33.06,2.03 32.78,1.98 32.6,1.97 30.57,1.97 30.39,1.98 30.11,2.03 29.84,2.11 29.58,2.23 29.35,2.38 29.13,2.57 28.95,2.78 28.79,3.02 28.67,3.28 28.59,3.55 28.54,3.83 28.54,4.01
VCC_BAT on Top Layer: 77.18,28.39 76.98,28.41 76.76,28.46 76.55,28.56 76.36,28.69 76.2,28.85 76.07,29.03 75.98,29.24 75.92,29.46 75.91,29.66 75.91,35.5 75.92,35.7 75.98,35.92 76.07,36.13 76.2,36.32 76.36,36.48 76.55,36.61 76.76,36.7 76.98,36.76 77.18,36.77 83.8,36.77 84,36.76 84.22,36.7 84.43,36.61 84.62,36.48 84.78,36.32 84.91,36.13 85,35.92 85.06,35.7 85.07,35.5 85.07,29.66 85.06,29.46 85,29.24 84.91,29.03 84.78,28.85 84.62,28.69 84.43,28.56 84.22,28.46 84,28.41 83.8,28.39
VCC_BAT on Inner2: 28.03,66.5 99.74,66.5 99.74,0.26 28.03,0.26
SH1_1 on Top Layer: 54.32,28.04 54.32,19.8 54.71,19.4 67.43,19.4 68.67,20.64 68.67,26.99 69.69,28.01 69.66,28.04
SH1_1 on Bottom Layer: 54.32,32.59 54.32,19.38 54.7,18.99 68.67,18.99 68.8,19.12 68.8,31.44 67.65,32.59
SH1_1 on Inner1: 54.44,32.84 68.67,32.84 68.67,19.53 54.44,19.53
SH1_1 on Inner2: 54.44,32.84 68.67,32.84 68.67,19.53 54.44,19.53
SH2_1 on Top Layer: 41.87,24.83 41.49,24.45 41.49,14.94 43.66,12.77 68.03,12.77 68.16,12.9 68.16,19.37 68.29,19.5 49.87,19.5 49.62,19.75 49.62,27.63 49.24,28.01 42.25,28.01 41.87,27.63
SH2_1 on Bottom Layer: 41.49,24.45 41.49,15.06 43.78,12.77 67.65,12.77 68.41,13.53 68.41,18.74 68.16,18.99 67.45,18.99 67.04,19.4 49.97,19.4 49.62,19.75 45.05,19.75 44.54,20.26 44.54,24.58 44.28,24.83 41.87,24.83
SH2_1 on Inner1: 41.62,24.71 66.3,24.71 66.3,12.9 41.62,12.9
SH2_1 on Inner2: 41.62,24.71 66.3,24.71 66.3,12.9 41.62,12.9
SP_1 on Top Layer: 50.08,39 54.32,39 54.32,35.27 50.08,35.27
SP_1 on Top Layer: 49.49,28.14 54.36,28.14 54.36,19.4 49.49,19.4
SP_1 on Inner1: 50.36,39.13 54.19,39.13 54.19,19.53 50.36,19.53
SP_1 on Inner2: 50.37,39.21 54.2,39.21 54.2,19.53 50.37,19.53
$3N3801 on Top Layer: 19.65,19.88 19.65,18.99 19.77,18.87 22.06,18.87 23.71,20.52 23.71,22.3 23.46,22.55 22.31,22.55
$3N3802 on Top Layer: 6.44,26.19 6.44,21.6 7.38,20.66 14.23,27.5 29.45,27.5 29.95,28.01 29.95,32.69 29.43,33.22 13.14,33.22 11.65,31.72 11.65,29.03 11.01,28.39
$3N3805 on Top Layer: 22.44,26.99 22.44,23.06 22.82,22.68 23.71,22.68 23.97,22.42 23.97,19.75 24.47,19.25 25.06,19.25 25.83,18.48 27.9,18.48 28.54,19.12 28.54,22.17 29.95,23.58 29.95,26.97 29.43,27.5 22.95,27.5
$3N3808 on Top Layer: 19.14,17.47 19.52,17.85 19.52,18.36 19.77,18.61 22.21,18.61 22.44,18.37 22.44,16.07 22.31,15.94 20.41,15.94 20.03,15.56 20.03,12.52 21.3,11.25 24.85,11.25 27.9,8.2 27.9,-1.07 27.01,-1.96 10.88,-1.96 -0.17,9.09 -0.17,17.47

Small or netless copper shapes (teardrops, artwork), in the pictures only: 1 on Inner1

## Text on the board
Bottom Silkscreen Layer: PH1 | VCC | EN1 | STL1 | GND | XXX | DIR1 | IOUT2 | BAT_ADC | JLCJLCJLC | Designed By / SongJC | Ver 1.1
Top Layer: 华侨大学 / 鹭岛躺赢狗 / 25.3.16
Top Silkscreen Layer: SLEEP | 5V | BAT | OFF | ON | V | G | 你是奶龙 | Ver 1.1 | + | - | 记得找女朋友 | 记得打瓦 | 记得打GO | 记得睡觉 | 记得休息 | 记得吃饭 | 记得充电
